# Altium schematic sheet VCO_SCH.SchDoc
size A4
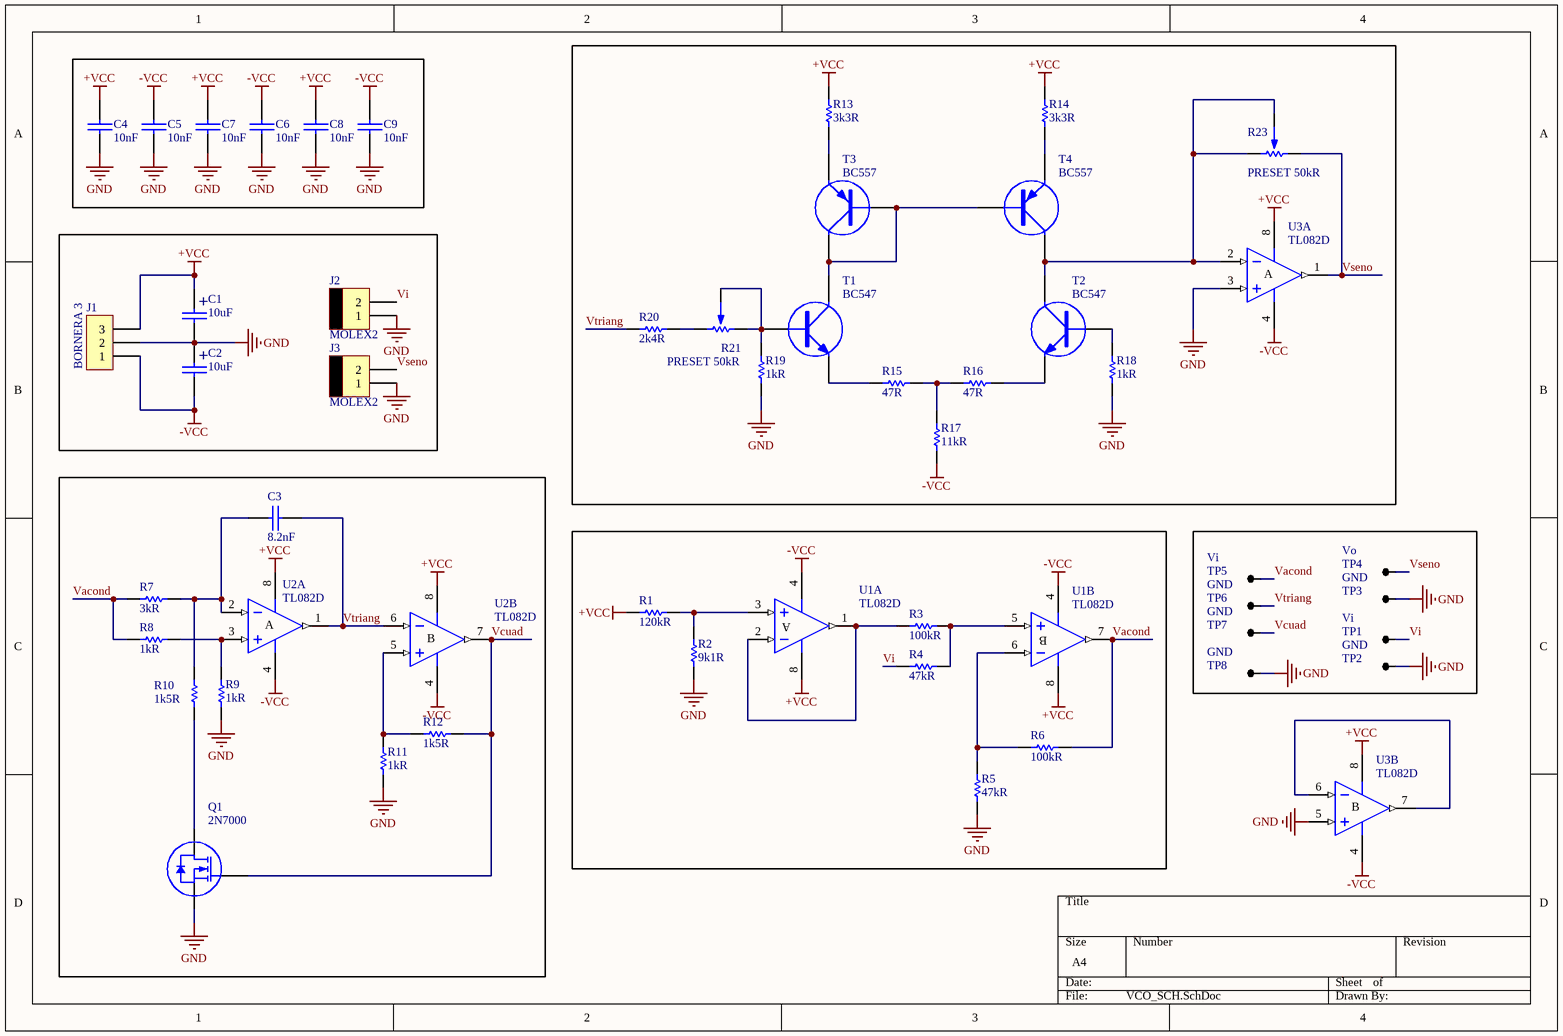
[diagram p0: VCO_SCH.SchDoc]

## Parts
C1  10uF  [CAP100RP]
C2  10uF  [CAP100RP]
C3  8.2nF  [0805]
C4  10nF  [0805]
C5  10nF  [0805]
C6  10nF  [0805]
C7  10nF  [0805]
C8  10nF  [0805]
C9  10nF  [0805]
J1  BORNERA 3  [BORNERA3]
J2  MOLEX2  [MOLEX2]
J3  MOLEX2  [MOLEX2]
Q1  2N7000  [TO92]
R1  120kR  [0805]
R2  9k1R  [0805]
R3  100kR  [0805]
R4  47kR  [0805]
R5  47kR  [0805]
R6  100kR  [0805]
R7  3kR  [0805]
R8  1kR  [0805]
R9  1kR  [0805]
R10  1k5R  [0805]
R11  1kR  [0805]
R12  1k5R  [0805]
R13  3k3R  [0805]
R14  3k3R  [0805]
R15  47R  [0805]
R16  47R  [0805]
R17  11kR  [0805]
R18  1kR  [0805]
R19  1kR  [0805]
R20  2k4R  [0805]
R21  PRESET 50kR  [PRESET V]
R23  PRESET 50kR  [PRESET V]
T1  BC547  [TO92]
T2  BC547  [TO92]
T3  BC557  [TO92]
T4  BC557  [TO92]
TP1  Vi  [TPTH]
TP2  GND  [TPTH]
TP3  GND  [TPTH]
TP4  Vo  [TPTH]
TP5  Vi  [TPTH]
TP6  GND  [TPTH]
TP7  GND  [TPTH]
TP8  GND  [TPTH]
U1  TL082D  [SOIC8]  (parts A,B of 2)
U2  TL082D  [SOIC8]  (parts A,B of 2)
U3  TL082D  [SOIC8]  (parts A,B of 2)

## Nets
+VCC: C1.1 C4.2 C7.2 C8.2 J1.3 R1.1 R13.1 R14.1 U1.8(V+) U2.8(V+) U3.8(V+)
-VCC: C2.2 C5.2 C6.2 C9.2 J1.1 R17.1 U1.4(V-) U2.4(V-) U3.4(V-)
GND: C1.2 C2.1 C4.1 C5.1 C6.1 C7.1 C8.1 C9.1 J1.2 J2.1 J3.1 Q1.3(S) R2.1 R5.1 R9.1 R11.2 R18.1 R19.1 TP2.1 TP3.1 TP8.1 U3.3(IN+) U3.5(IN+)
Vacond: R6.2 R7.1 R8.1 TP5.1 U1.7(OUT)
Vcuad: Q1.1(G) R12.2 TP7.1 U2.7(OUT)
Vi: J2.2 R4.1 TP1.1
Vseno: J3.2 R23.3 TP4.1 U3.1(OUT)
Vtriang: C3.2 R20.1 TP6.1 U2.1(OUT) U2.6(IN-)
NetC3_1: C3.1 R7.2 R10.1 U2.2(IN-)
NetQ1_2: Q1.2(D) R10.2
NetR1_2: R1.2 R2.2 U1.3(IN+)
NetR3_1: R3.1 R4.2 U1.5(IN+)
NetR3_2: R3.2 U1.1(OUT) U1.2(IN-)
NetR5_2: R5.2 R6.1 U1.6(IN-)
NetR8_2: R8.2 R9.2 U2.3(IN+)
NetR11_1: R11.1 R12.1 U2.5(IN+)
NetR13_2: R13.2 T3.3(E)
NetR14_2: R14.2 T4.3(E)
NetR15_1: R15.1 T1.3(E)
NetR15_2: R15.2 R16.1 R17.2
NetR16_2: R16.2 T2.3(E)
NetR18_2: R18.2 T2.1(B)
NetR19_2: R19.2 R21.2 R21.3 T1.1(B)
NetR20_2: R20.2 R21.1
NetR23_1: R23.1 R23.2 T2.2(C) T4.2(C) U3.2(IN-)
NetT1_2: T1.2(C) T3.1(B) T3.2(C) T4.1(B)
NetU3_6: U3.6(IN-) U3.7(OUT)

## Notes on the sheet
- (in symbol CAPPOL) +
- (in symbol TL082D, part A) A
- (in symbol TL082D, part B) B

## Library data of the parts
C1 C2 = CAPPOL: Value: 10uF; Footprint: THT
C3-C9 = CAP: Footprint: SMD 0805
  C3: Value: 8.2nF
  C4-C9: Value: 10nF
Q1 = MOSFET N: Value: 2N7000; Footprint: T0-92
R1-R20 = RES: Footprint: SMD 0805
  R1: Value: 120kR
  R2: Value: 9k1R
  R3 R6: Value: 100kR
  R4 R5: Value: 47kR
  R7: Value: 3kR
  R8 R9 R11 R18 R19: Value: 1kR
  R10 R12: Value: 1k5R
  R13 R14: Value: 3k3R
  R15 R16: Value: 47R
  R17: Value: 11kR
  R20: Value: 2k4R
R21 R23 = PRESET: Value: 50kR; Footprint: PRESET
T1 T2 = TRANSISTOR NPN: Value: BC547; Footprint: T0-92
T3 T4 = TRANSISTOR PNP: Value: BC557; Footprint: TO-92
TP1-TP8 = TP
U1-U3 = TL082D: JFET-Input Operational Amplifier; Value: TL082; Footprint: SMD
J1 = BORNERA 3: Value: BORNERA3
J2 J3 = MOLEX2: Value: MOLEX2